# EAGLE schematic SG circuit (EAGLE 9.5.0)
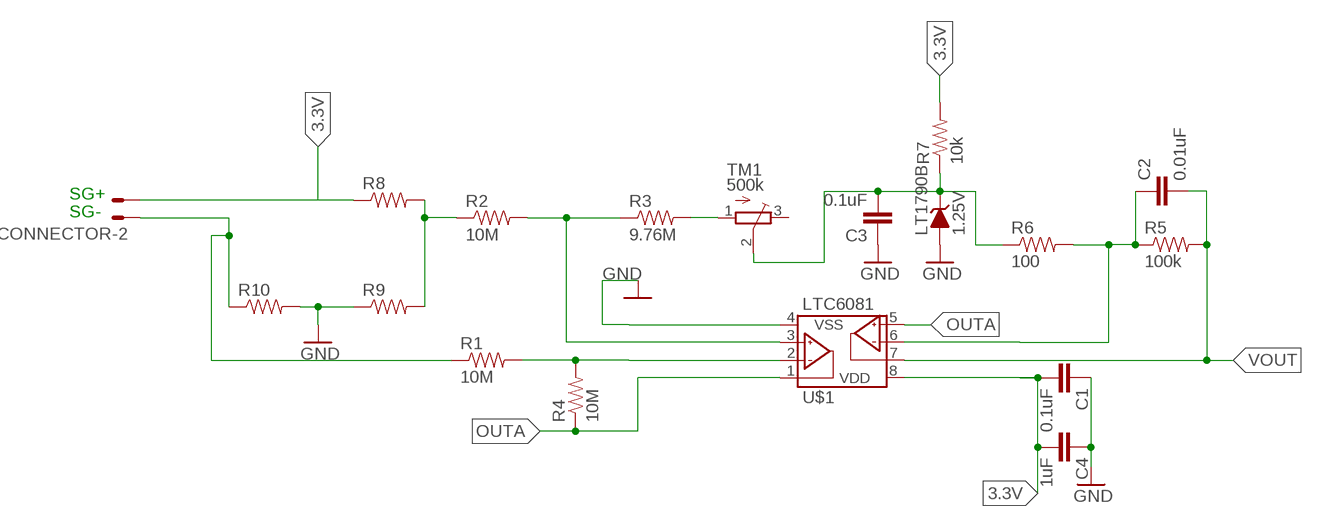
[diagram p0: schematic, sheet 1]

## Parts
C1  0.1uF  CAP0805  [0805]
C2  0.01uF  CAP0805  [0805]
C3  0.1uF  CAP0805  [0805]
C4  1uF  CAP0805  [0805]
LT1790B  1.25V  DIODE_ZENER0805  [0805_D]
R1  10M  RESISTOR0805-RES  [0805]
R2  10M  RESISTOR0805-RES  [0805]
R3  9.76M  RESISTOR0805-RES  [0805]
R4  10M  RESISTOR0805-RES  [0805]
R5  100k  RESISTOR0805-RES  [0805]
R6  100  RESISTOR0805-RES  [0805]
R7  10k  RESISTOR0805-RES  [0805]
R8  RESISTOR0805-RES  [0805]
R9  RESISTOR0805-RES  [0805]
R10  RESISTOR0805-RES  [0805]
SG+  CONNECTOR-2  [MINIFIT_5566-2]
TM1  500k  TRIMPOTTC33X  [TC33X]
U$1  LTC6081  [MSOP-8_MS]

## Nets
3.3V: C1.2 C4.2 R7.2 R8.1 SG+.2 U$1.8(VDD)
GND: C1.1 C3.1 C4.1 LT1790B.A R9.1 R10.2 U$1.4(VSS)
INB-: C2.1 R5.1 R6.2 U$1.6(VINB-)
N$1: R1.2 R4.2 U$1.2(VINA-)
N$2: R2.2 R3.1 U$1.3(VINA+)
N$3: C3.2 LT1790B.C R6.1 R7.1 TM1.2(S)
N$5: R3.2 TM1.1(A)
OUTA: R4.1 U$1.1(VOUTA) U$1.5(VINB+)
V+: R1.1 R10.1 SG+.1
V-: R2.1 R8.2 R9.2
VOUT: C2.2 R5.2 U$1.7(VOUTB)
Unconnected: TM1.3(E)

## Notes on the sheet
- SG+
- SG-

## Library data of the parts
C1-C4 = HyTechDevices:CAP: Capacitor Standard 0603 ceramic capacitor, and 0.1" leaded capacitor.
LT1790B = HyTechDevices:DIODE_ZENER: ZENER DIODE
R1-R10 = HyTechDevices:RESISTOR: Resistor Basic schematic elements and footprints for 0603, 1206, and PTH resistors.
SG+ = HyTechDevices:CONNECTOR-2: Mini-Fit Junior connector 2 pole Source: http://www.molex.com; OC_FARNELL: 1822072; OC_NEWARK: unknown
TM1 = HyTechDevices:TRIMPOT: SMT trimmer potentiometer part number TC33X http://www.ladyada.net/library/eagle
U$1 = HyTechDevices:LTC6081